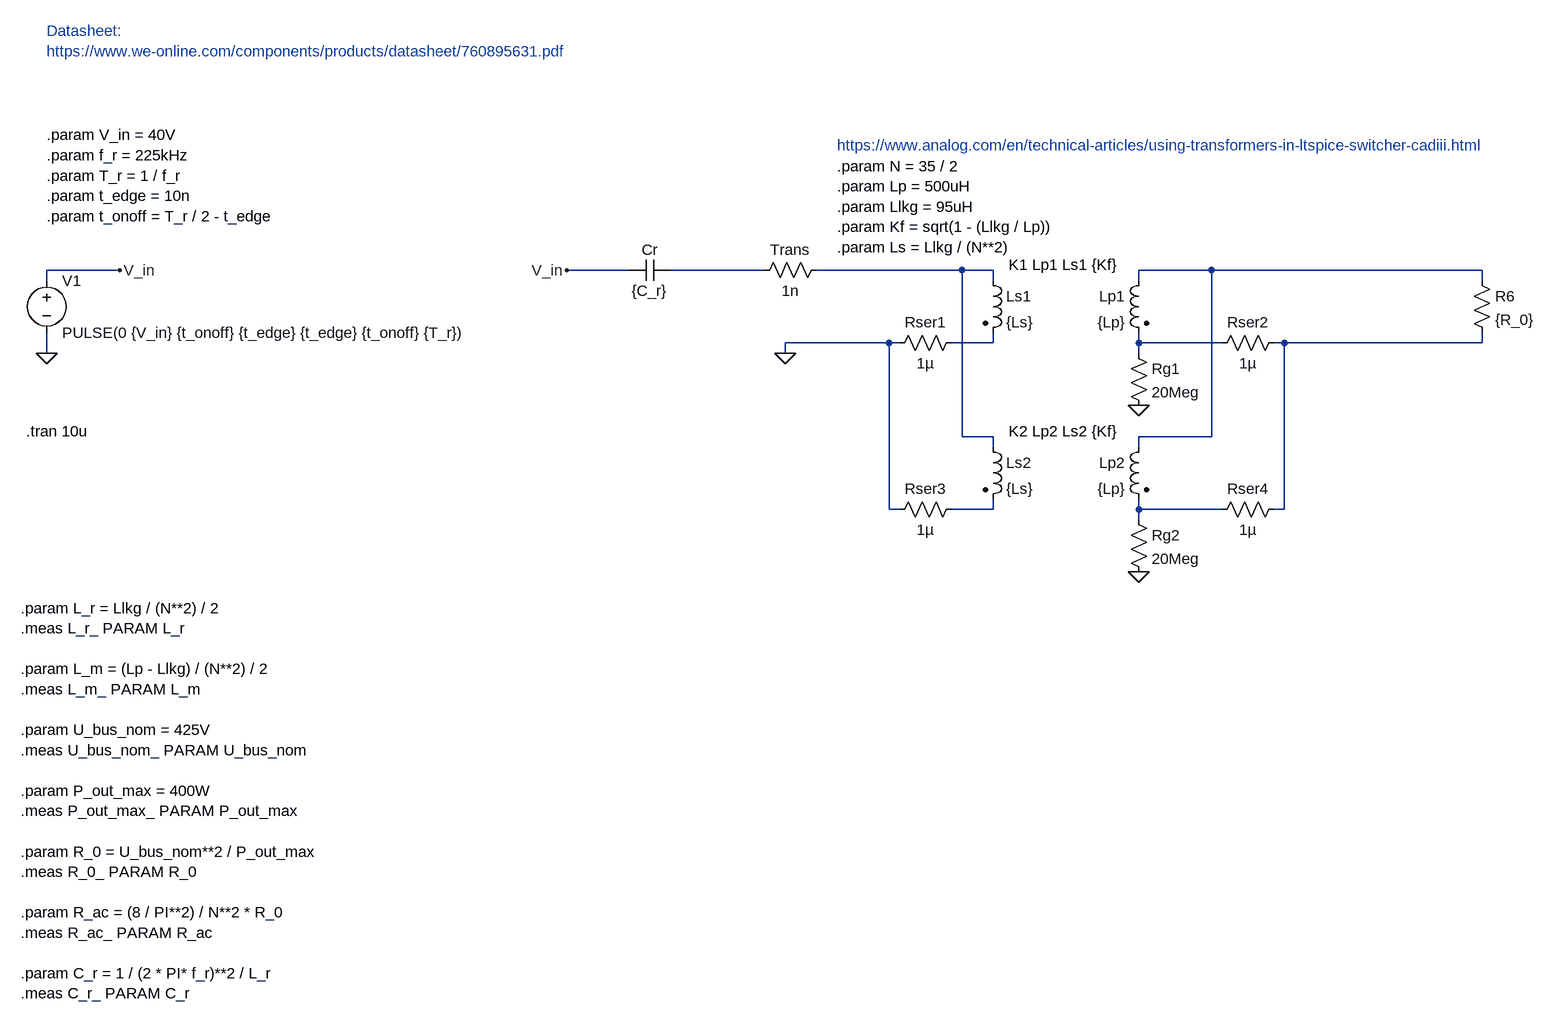
[diagram p0: schematic llc-transformer.asc]
llc-transformer.asc, the LTspice schematic file:
Version 4
SHEET 1 3940 1956
WIRE -352 48 -464 48
WIRE 432 48 336 48
WIRE 640 48 496 48
WIRE 944 48 720 48
WIRE 992 48 944 48
WIRE 1328 48 1216 48
WIRE 1744 48 1328 48
WIRE -464 64 -464 48
WIRE 992 64 992 48
WIRE 1216 64 1216 48
WIRE 1744 64 1744 48
WIRE 832 160 672 160
WIRE 848 160 832 160
WIRE 992 160 992 144
WIRE 992 160 928 160
WIRE 1216 160 1216 144
WIRE 1344 160 1216 160
WIRE 1440 160 1424 160
WIRE 1744 160 1744 144
WIRE 1744 160 1440 160
WIRE -464 176 -464 144
WIRE 672 176 672 160
WIRE 1216 176 1216 160
WIRE 944 304 944 48
WIRE 992 304 944 304
WIRE 1328 304 1328 48
WIRE 1328 304 1216 304
WIRE 992 320 992 304
WIRE 1216 320 1216 304
WIRE 832 416 832 160
WIRE 848 416 832 416
WIRE 992 416 992 400
WIRE 992 416 928 416
WIRE 1216 416 1216 400
WIRE 1344 416 1216 416
WIRE 1440 416 1440 160
WIRE 1440 416 1424 416
WIRE 1216 432 1216 416
FLAG -464 176 0
FLAG -352 48 V_in
FLAG 1216 256 0
FLAG 672 176 0
FLAG 336 48 V_in
FLAG 1216 512 0
SYMBOL voltage -464 48 R0
WINDOW 123 0 0 Left 0
WINDOW 39 0 0 Left 0
SYMATTR InstName V1
SYMATTR Value PULSE(0 {V_in} {t_onoff} {t_edge} {t_edge} {t_onoff} {T_r})
SYMBOL ind2 976 48 R0
SYMATTR InstName Ls1
SYMATTR Value {Ls}
SYMATTR Type ind
SYMBOL ind2 1232 48 M0
SYMATTR InstName Lp1
SYMATTR Value {Lp}
SYMATTR Type ind
SYMBOL res 1200 160 R0
SYMATTR InstName Rg1
SYMATTR Value 20Meg
SYMBOL res 624 64 R270
WINDOW 0 32 56 VTop 2
WINDOW 3 0 56 VBottom 2
SYMATTR InstName Trans
SYMATTR Value 1n
SYMBOL res 1728 48 R0
SYMATTR InstName R6
SYMATTR Value {R_0}
SYMBOL res 944 144 R90
WINDOW 0 0 56 VBottom 2
WINDOW 3 32 56 VTop 2
SYMATTR InstName Rser1
SYMATTR Value 1µ
SYMBOL ind2 976 304 R0
SYMATTR InstName Ls2
SYMATTR Value {Ls}
SYMATTR Type ind
SYMBOL ind2 1232 304 M0
SYMATTR InstName Lp2
SYMATTR Value {Lp}
SYMATTR Type ind
SYMBOL res 1200 416 R0
SYMATTR InstName Rg2
SYMATTR Value 20Meg
SYMBOL res 944 400 R90
WINDOW 0 0 56 VBottom 2
WINDOW 3 32 56 VTop 2
SYMATTR InstName Rser3
SYMATTR Value 1µ
SYMBOL res 1440 144 R90
WINDOW 0 0 56 VBottom 2
WINDOW 3 32 56 VTop 2
SYMATTR InstName Rser2
SYMATTR Value 1µ
SYMBOL res 1440 400 R90
WINDOW 0 0 56 VBottom 2
WINDOW 3 32 56 VTop 2
SYMATTR InstName Rser4
SYMATTR Value 1µ
SYMBOL cap 496 32 R90
WINDOW 0 0 32 VBottom 2
WINDOW 3 32 32 VTop 2
SYMATTR InstName Cr
SYMATTR Value {C_r}
TEXT -496 296 Left 2 !.tran 10u
TEXT 752 -112 Left 2 !.param N = 35 / 2\n.param Lp = 500uH\n.param Llkg = 95uH\n.param Kf = sqrt(1 - (Llkg / Lp))\n.param Ls = Llkg / (N**2)
TEXT 752 -144 Left 2 ;https://www.analog.com/en/technical-articles/using-transformers-in-ltspice-switcher-cadiii.html
TEXT 1016 40 Left 2 !K1 Lp1 Ls1 {Kf}
TEXT -464 -320 Left 2 ;Datasheet:\nhttps://www.we-online.com/components/products/datasheet/760895631.pdf
TEXT -504 568 Left 2 !.param L_r = Llkg / (N**2) / 2\n.meas L_r_ PARAM L_r\n \n.param L_m = (Lp - Llkg) / (N**2) / 2\n.meas L_m_ PARAM L_m\n \n.param U_bus_nom = 425V\n.meas U_bus_nom_ PARAM U_bus_nom\n \n.param P_out_max = 400W\n.meas P_out_max_ PARAM P_out_max\n \n.param R_0 = U_bus_nom**2 / P_out_max\n.meas R_0_ PARAM R_0\n \n.param R_ac = (8 / PI**2) / N**2 * R_0\n.meas R_ac_ PARAM R_ac\n \n.param C_r = 1 / (2 * PI* f_r)**2 / L_r\n.meas C_r_ PARAM C_r
TEXT -464 -160 Left 2 !.param V_in = 40V\n.param f_r = 225kHz\n.param T_r = 1 / f_r \n.param t_edge = 10n\n.param t_onoff = T_r / 2 - t_edge
TEXT 1016 296 Left 2 !K2 Lp2 Ls2 {Kf}

The netlist it stands for:
* llc-transformer.asc
V1 V_in 0 PULSE(0 {V_in} {t_onoff} {t_edge} {t_edge} {t_onoff} {T_r})
Ls1 N002 N004 {Ls}
Lp1 N003 N005 {Lp}
Rg1 N005 0 20Meg
R§Trans N001 N002 1n
R6 N003 N006 {R_0}
Rser1 N004 0 1µ
Ls2 N002 N007 {Ls}
Lp2 N003 N008 {Lp}
Rg2 N008 0 20Meg
Rser3 N007 0 1µ
Rser2 N006 N005 1µ
Rser4 N006 N008 1µ
Cr N001 V_in {C_r}
.tran 10u
.param N = 35 / 2
.param Lp = 500uH
.param Llkg = 95uH
.param Kf = sqrt(1 - (Llkg / Lp))
.param Ls = Llkg / (N**2)
* https://www.analog.com/en/technical-articles/using-transformers-in-ltspice-switcher-cadiii.html
K1 Lp1 Ls1 {Kf}
* Datasheet:
* https://www.we-online.com/components/products/datasheet/760895631.pdf
.param L_r = Llkg / (N**2) / 2
.meas L_r_ PARAM L_r
.param L_m = (Lp - Llkg) / (N**2) / 2
.meas L_m_ PARAM L_m
.param U_bus_nom = 425V
.meas U_bus_nom_ PARAM U_bus_nom
.param P_out_max = 400W
.meas P_out_max_ PARAM P_out_max
.param R_0 = U_bus_nom**2 / P_out_max
.meas R_0_ PARAM R_0
.param R_ac = (8 / PI**2) / N**2 * R_0
.meas R_ac_ PARAM R_ac
.param C_r = 1 / (2 * PI* f_r)**2 / L_r
.meas C_r_ PARAM C_r
.param V_in = 40V
.param f_r = 225kHz
.param T_r = 1 / f_r
.param t_edge = 10n
.param t_onoff = T_r / 2 - t_edge
K2 Lp2 Ls2 {Kf}
.backanno
.end